# EAGLE schematic pi_day_2025 (EAGLE 9.6.2)

## Sheet 1 of 4
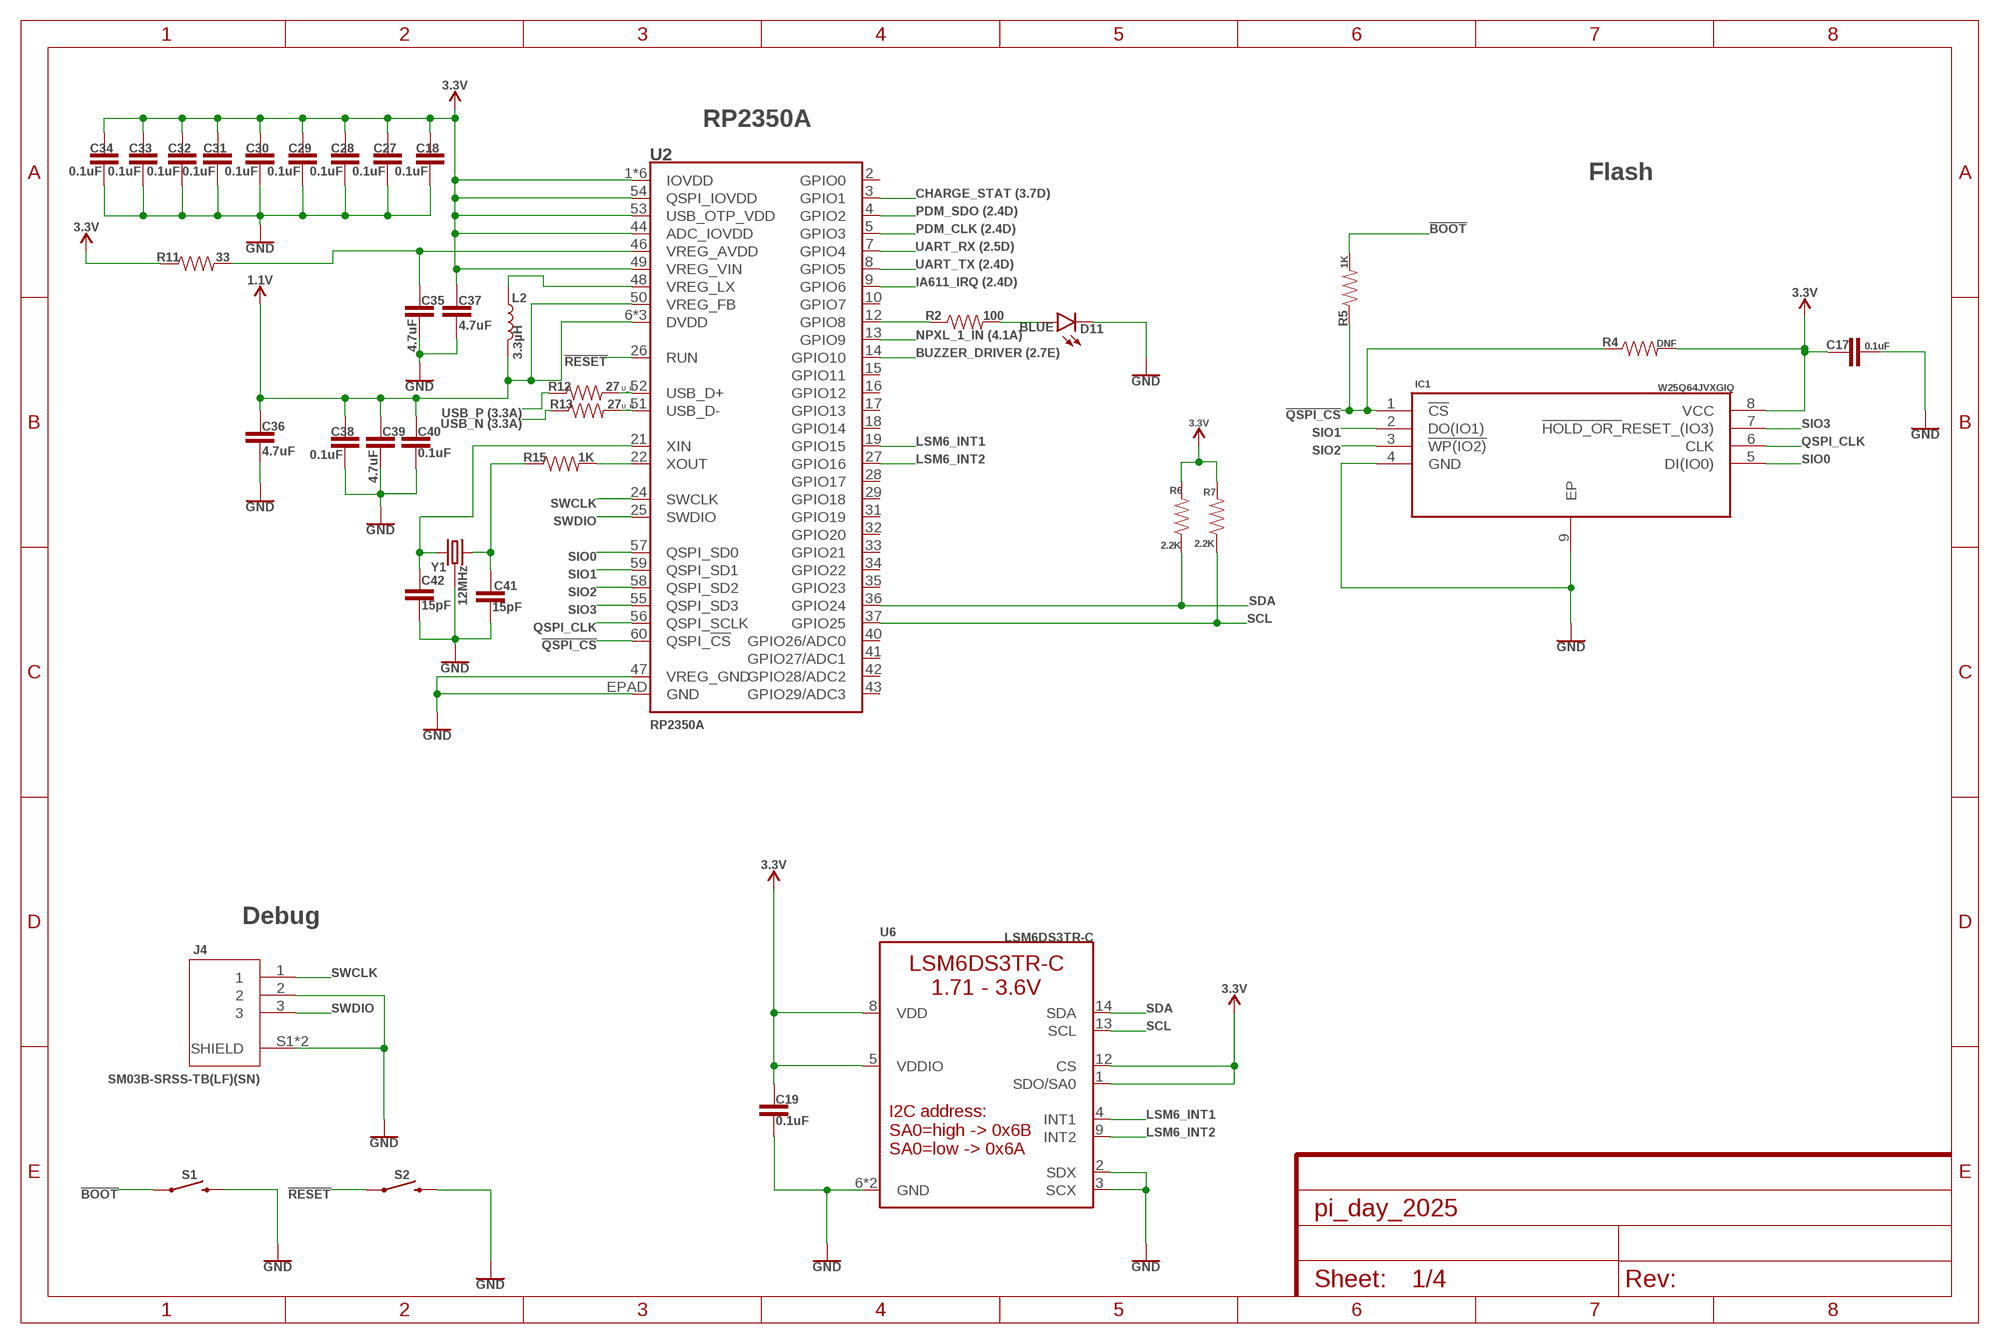
[diagram p0: schematic, sheet 1]

### Parts
C17  0.1uF  0.1UF-0402-16V-10%  [0402]
C18  0.1uF  0.1UF-0402T-16V-10%-X7R-WE  [0402-TIGHT]
C19  0.1uF  0.1UF-0402T-16V-10%-X7R-WE  [0402-TIGHT]
C27  0.1uF  0.1UF-0402T-16V-10%-X7R-WE  [0402-TIGHT]
C28  0.1uF  0.1UF-0402T-16V-10%-X7R-WE  [0402-TIGHT]
C29  0.1uF  0.1UF-0402T-16V-10%-X7R-WE  [0402-TIGHT]
C30  0.1uF  0.1UF-0402T-16V-10%-X7R-WE  [0402-TIGHT]
C31  0.1uF  0.1UF-0402T-16V-10%-X7R-WE  [0402-TIGHT]
C32  0.1uF  0.1UF-0402T-16V-10%-X7R-WE  [0402-TIGHT]
C33  0.1uF  0.1UF-0402T-16V-10%-X7R-WE  [0402-TIGHT]
C34  0.1uF  0.1UF-0402T-16V-10%-X7R-WE  [0402-TIGHT]
C35  4.7uF  4.7UF-0402_TIGHT-6.3V-20%-X5R  [0402-TIGHT]
C36  4.7uF  4.7UF-0402_TIGHT-6.3V-20%-X5R  [0402-TIGHT]
C37  4.7uF  4.7UF-0402_TIGHT-6.3V-20%-X5R  [0402-TIGHT]
C38  0.1uF  0.1UF-0402T-16V-10%-X7R-WE  [0402-TIGHT]
C39  4.7uF  4.7UF-0402_TIGHT-6.3V-20%-X5R  [0402-TIGHT]
C40  0.1uF  0.1UF-0402T-16V-10%-X7R-WE  [0402-TIGHT]
C41  15pF  15PF-0402-50V-5%  [0402]
C42  15pF  15PF-0402-50V-5%  [0402]
D11  BLUE  LED-BLUE0603  [LED-0603]
IC1  W25Q64JVXGIQ  [SON80P400X400X50-9N]
J4  SM03B-SRSS-TB(LF)(SN)  [JST_SM03B-SRSS-TB(LF)(SN)]
L2  3.3µH  INDUCTOR-0805-3.3UH  [0805]
R2  100  100OHM-0402-TIGHT-1/16W-1%  [0402-TIGHT]
R4  DNF  RESISTOR0402  [0402@1]
R5  1K  RESISTOR0402  [0402@1]
R6  2.2K  RESISTOR0402  [0402@1]
R7  2.2K  RESISTOR0402  [0402@1]
R11  33  33OHM-0402-1/10W-1%  [0402@1]
R12  27  27OHM  [0402-TIGHT]
R13  27  27OHM  [0402-TIGHT]
R15  1K  1KOHM-0402-1/16W-1%  [0402@1]
S1  MOMENTARY-SWITCH-SPST-SMD-4.6X2.8MM  [TACTILE_SWITCH_SMD_4.6X2.8MM]
S2  MOMENTARY-SWITCH-SPST-SMD-4.6X2.8MM  [TACTILE_SWITCH_SMD_4.6X2.8MM]
U2  RP2350A  [RP2350A]
U6  LSM6DS3TR-C  [LGA-14-2.5X3MM]
Y1  12MHz  CRYSTAL-GROUNDEDSMD-3.2X2.5  [CRYSTAL-SMD-3.2X2.5MM]

### Nets
1.1V: C36.1 C38.1 C39.1 C40.1 L2.2 U2.6(DVDD) U2.23(DVDD) U2.39(DVDD) U2.50(VREG_FB)
3.3V: C17.1 C18.1 C19.1 C27.1 C28.1 C29.1 C30.1 C31.1 C32.1 C33.1 C34.1 C37.1 IC1.8(VCC) R4.2 R6.2 R7.2 R11.1 U2.1(IOVDD) U2.11(IOVDD) U2.20(IOVDD) U2.30(IOVDD) U2.38(IOVDD) U2.44(ADC_IOVDD) U2.45(IOVDD) U2.49(VREG_VIN) U2.53(USB_OTP_VDD) U2.54(QSPI_IOVDD) U6.1(SDO/SA0) U6.5(VDDIO) U6.8(VDD) U6.12(CS) ; also sheet 2,3,4
!BOOT: R5.2 S1.1 S1.2
!QSPI_CS: IC1.1(!CS) R4.1 R5.1 U2.60(QSPI_!CS!)
!RESET: S2.1 S2.2 U2.26(RUN)
BUZZER_DRIVER: U2.14(GPIO10) ; also sheet 2
CHARGE_STAT: U2.3(GPIO1) ; also sheet 3
GND: C17.2 C18.2 C19.2 C27.2 C28.2 C29.2 C30.2 C31.2 C32.2 C33.2 C34.2 C35.2 C36.2 C37.2 C38.2 C39.2 C40.2 C41.2 C42.2 D11.C IC1.4(GND) IC1.9(EP) J4.2 J4.S1(SHIELD) J4.S2(SHIELD) S1.3 S1.4 S2.3 S2.4 U2.47(VREG_GND) U2.EPAD(GND) U6.2(SDX) U6.3(SCX) U6.6(GND) U6.7(GND) Y1.2(GND) Y1.4(GND) ; also sheet 2,3,4
IA611_IRQ: U2.9(GPIO6) ; also sheet 2
LSM6_INT1: U2.19(GPIO15) U6.4(INT1)
LSM6_INT2: U2.27(GPIO16) U6.9(INT2)
N$1: R2.1 U2.12(GPIO8)
N$2: C35.1 R11.2 U2.46(VREG_AVDD)
N$4: D11.A R2.2
N$5: L2.1 U2.48(VREG_LX)
N$11: C41.1 R15.1 Y1.3
N$12: C42.1 U2.21(XIN) Y1.1
N$13: R15.2 U2.22(XOUT)
NPXL_1_IN: U2.13(GPIO9) ; also sheet 4
PDM_CLK: U2.5(GPIO3) ; also sheet 2
PDM_SDO: U2.4(GPIO2) ; also sheet 2
QSPI_CLK: IC1.6(CLK) U2.56(QSPI_SCLK)
SCL: R7.1 U2.37(GPIO25) U6.13(SCL)
SDA: R6.1 U2.36(GPIO24) U6.14(SDA)
SIO0: IC1.5(DI(IO0)) U2.57(QSPI_SD0)
SIO1: IC1.2(DO(IO1)) U2.59(QSPI_SD1)
SIO2: IC1.3(!WP(IO2)) U2.58(QSPI_SD2)
SIO3: IC1.7(!HOLD_OR_!RESET_(IO3)) U2.55(QSPI_SD3)
SWCLK: J4.1 U2.24(SWCLK)
SWDIO: J4.3 U2.25(SWDIO)
U_N: R13.2 U2.51(USB_D-)
U_P: R12.2 U2.52(USB_D+)
UART_RX: U2.7(GPIO4) ; also sheet 2
UART_TX: U2.8(GPIO5) ; also sheet 2
USB_N [USB]: R13.1 ; also sheet 3
USB_P [USB]: R12.1 ; also sheet 3
Unconnected: U2.2(GPIO0) U2.10(GPIO7) U2.15(GPIO11) U2.16(GPIO12) U2.17(GPIO13) U2.18(GPIO14) U2.28(GPIO17) U2.29(GPIO18) U2.31(GPIO19) U2.32(GPIO20) U2.33(GPIO21) U2.34(GPIO22) U2.35(GPIO23) U2.40(GPIO26/ADC0) U2.41(GPIO27/ADC1) U2.42(GPIO28/ADC2) U2.43(GPIO29/ADC3)

### Notes on the sheet
- RP2350A
- Flash
- Debug

## Sheet 2 of 4
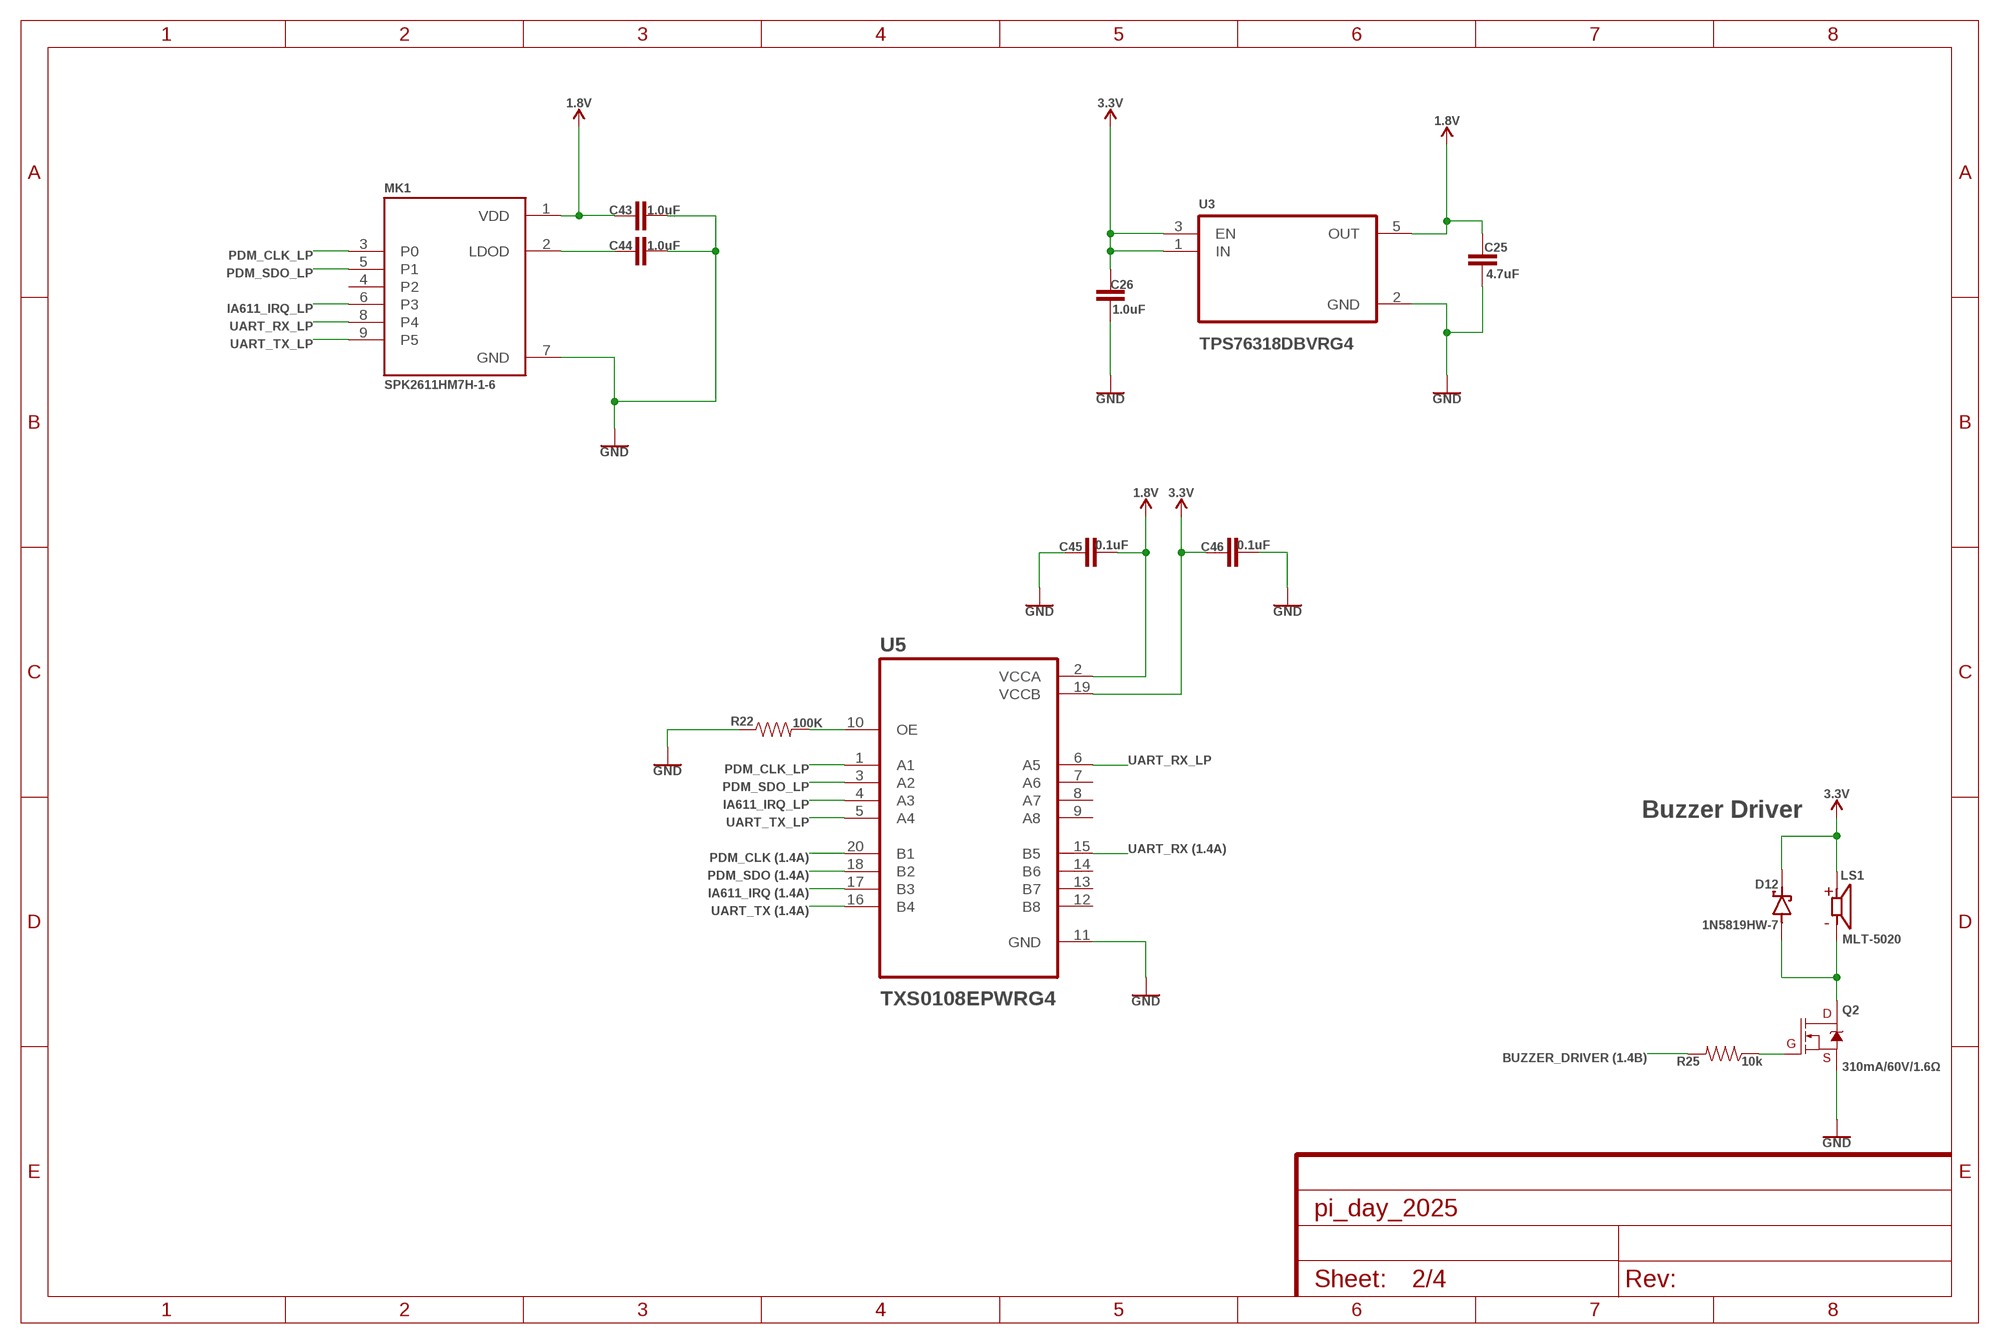
[diagram p1: schematic, sheet 2]

### Parts
C25  4.7uF  4.7UF-0402_TIGHT-6.3V-20%-X5R  [0402-TIGHT]
C26  1.0uF  1.0UF-0402-16V-10%  [0402]
C43  1.0uF  1.0UF-0402-16V-10%  [0402]
C44  1.0uF  1.0UF-0402-16V-10%  [0402]
C45  0.1uF  0.1UF-0402-6.3V-10%-X7R  [0402]
C46  0.1uF  0.1UF-0402-6.3V-10%-X7R  [0402]
D12  1N5819HW-7  [SOD3715X145N]
LS1  MLT-5020  CSS-0575A-SMT  [CUI_CSS-0575A-SMT]
MK1  SPK2611HM7H-1-6  [MIC_SPK2611HM7H-1-6]
Q2  310mA/60V/1.6Ω  MOSFET-NCH-2N7002PW  [SOT323]
R22  100K  100KOHM-0402-1/16W-1%  [0402@1]
R25  10k  10KOHM-0402-1/16W-1%  [0402]
U3  TPS76318DBVRG4  [SOT95P280X145-5N]
U5  TXS0108EPWRG4  [SOP65P640X120-20N]

### Nets
1.8V: C25.1 C43.1 C45.2 MK1.1(VDD) U3.5(OUT) U5.2(VCCA)
3.3V: C26.1 C46.1 D12.C(K) LS1.1(P) U3.1(IN) U3.3(EN) U5.19(VCCB) ; also sheet 1,3,4
BUZZER_DRIVER: R25.2 ; also sheet 1
GND: C25.2 C26.2 C43.2 C44.2 C45.1 C46.2 MK1.7(GND) Q2.2(S) R22.1 U3.2(GND) U5.11(GND) ; also sheet 1,3,4
IA611_IRQ: U5.17(B3) ; also sheet 1
IA611_IRQ_LP: MK1.6(P3) U5.4(A3)
N$23: C44.1 MK1.2(LDOD)
N$24: R22.2 U5.10(OE)
N$26: D12.A LS1.2(N) Q2.3(D)
N$27: Q2.1(G) R25.1
PDM_CLK: U5.20(B1) ; also sheet 1
PDM_CLK_LP: MK1.3(P0) U5.1(A1)
PDM_SDO: U5.18(B2) ; also sheet 1
PDM_SDO_LP: MK1.5(P1) U5.3(A2)
UART_RX: U5.15(B5) ; also sheet 1
UART_RX_LP: MK1.8(P4) U5.6(A5)
UART_TX: U5.16(B4) ; also sheet 1
UART_TX_LP: MK1.9(P5) U5.5(A4)
Unconnected: MK1.4(P2) U5.7(A6) U5.8(A7) U5.9(A8) U5.12(B8) U5.13(B7) U5.14(B6)

### Notes on the sheet
- Buzzer Driver

## Sheet 3 of 4
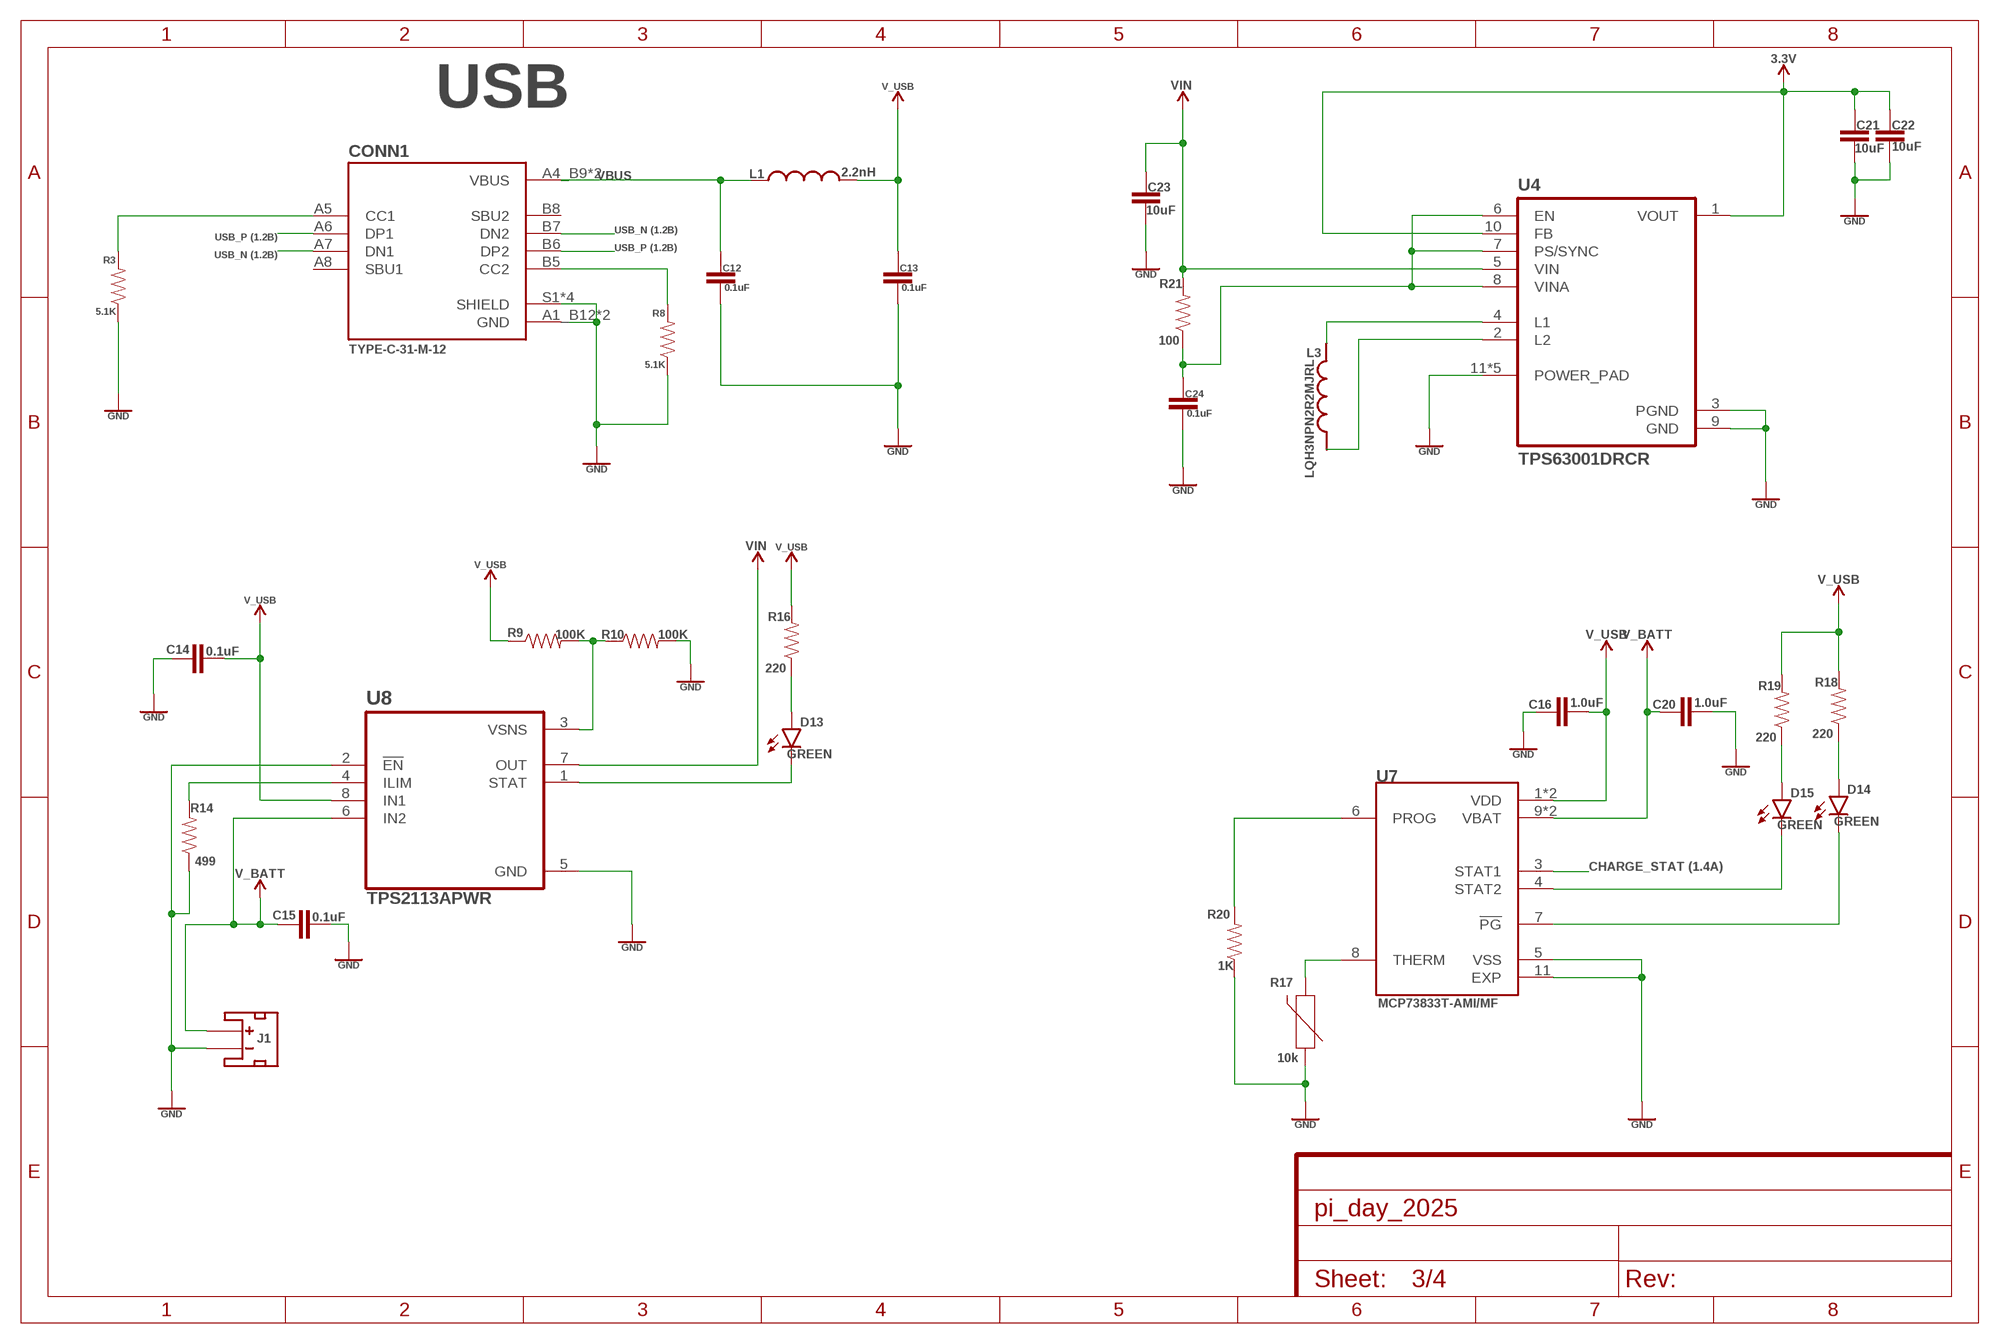
[diagram p2: schematic, sheet 3]

### Parts
C12  0.1uF  0.1UF-0402-16V-10%  [0402]
C13  0.1uF  0.1UF-0402-16V-10%  [0402]
C14  0.1uF  0.1UF-0402-10V-10%-X7R  [0402]
C15  0.1uF  0.1UF-0402-10V-10%-X7R  [0402]
C16  1.0uF  1.0UF-0402-16V-10%  [0402]
C20  1.0uF  1.0UF-0402-16V-10%  [0402]
C21  10uF  10UF-0402T-6.3V-20%  [0402-TIGHT]
C22  10uF  10UF-0402T-6.3V-20%  [0402-TIGHT]
C23  10uF  10UF-0402T-6.3V-20%  [0402-TIGHT]
C24  0.1uF  0.1UF-0402-16V-10%  [0402]
CONN1  TYPE-C-31-M-12  [HRO_TYPE-C-31-M-12]
D13  GREEN  LED-GREEN0603  [LED-0603]
D14  GREEN  LED-GREEN0603  [LED-0603]
D15  GREEN  LED-GREEN0603  [LED-0603]
J1  JST_2MM_MALE  [JST-2-SMD]
L1  2.2nH  LQW18AN2N2D10D  [INDC1608X100N]
L3  LQH3NPN2R2MJRL  [IND_LQH3NPN2R2MJRL]
R3  5.1K  RESISTOR0402  [0402@1]
R8  5.1K  RESISTOR0402  [0402@1]
R9  100K  100KOHM-0402-1/16W-1%  [0402@1]
R10  100K  100KOHM-0402-1/16W-1%  [0402@1]
R14  499  RESISTOR0402  [0402@1]
R16  220  220OHM-0402-TIGHT-1/16W-1%  [0402-TIGHT]
R17  10k  NTC-THERMISTOR-0603  [0603]
R18  220  220OHM-0402-TIGHT-1/16W-1%  [0402-TIGHT]
R19  220  220OHM-0402-TIGHT-1/16W-1%  [0402-TIGHT]
R20  1K  1KOHM-0402-1/16W-1%  [0402@1]
R21  100  100OHM-0402-TIGHT-1/16W-1%  [0402-TIGHT]
U4  TPS63001DRCR  [VREG_V62/16624-01YE]
U7  MCP73833T-AMI/MF  [SON50P300X300X100-11N]
U8  TPS2113APWR  [SOP65P640X120-8N]

### Nets
3.3V: C21.1 C22.1 U4.1(VOUT) U4.10(FB) ; also sheet 1,2,4
CHARGE_STAT: U7.3(STAT1) ; also sheet 1
GND: C12.2 C13.2 C14.1 C15.2 C16.1 C20.2 C21.2 C22.2 C23.2 C24.2 CONN1.A1_B12(GND) CONN1.B1_A12(GND) CONN1.S1(SHIELD) CONN1.S2(SHIELD) CONN1.S3(SHIELD) CONN1.S4(SHIELD) J1.1(-) R3.1 R8.1 R10.2 R14.1 R17.1 R20.1 U4.3(PGND) U4.9(GND) U4.11(POWER_PAD) U4.12(POWER_PAD) U4.13(POWER_PAD) U4.14(POWER_PAD) U4.15(POWER_PAD) U7.5(VSS) U7.11(EXP) U8.2(!EN) U8.5(GND) ; also sheet 1,2,4
N$3: CONN1.A5(CC1) R3.2
N$6: R9.2 R10.1 U8.3(VSNS)
N$7: CONN1.B5(CC2) R8.2
N$8: R14.2 U8.4(ILIM)
N$9: D13.A R16.1
N$10: D13.C U8.1(STAT)
N$14: R17.2 U7.8(THERM)
N$15: D14.A R18.1
N$16: D14.C U7.7(!PG)
N$17: D15.A R19.1
N$18: D15.C U7.4(STAT2)
N$19: R20.2 U7.6(PROG)
N$20: L3.2 U4.4(L1)
N$21: L3.1 U4.2(L2)
N$22: C24.1 R21.1 U4.6(EN) U4.7(PS/SYNC) U4.8(VINA)
USB_N [USB]: CONN1.A7(DN1) CONN1.B7(DN2) ; also sheet 1
USB_P [USB]: CONN1.A6(DP1) CONN1.B6(DP2) ; also sheet 1
V_BATT: C15.1 C20.1 J1.2(+) U7.9(VBAT) U7.10(VBAT) U8.6(IN2)
V_USB: C13.1 C14.2 C16.2 L1.2 R9.1 R16.2 R18.2 R19.2 U7.1(VDD) U7.2(VDD) U8.8(IN1)
VBUS: C12.1 CONN1.A4_B9(VBUS) CONN1.B4_A9(VBUS) L1.1
VIN: C23.1 R21.2 U4.5(VIN) U8.7(OUT)
Unconnected: CONN1.A8(SBU1) CONN1.B8(SBU2) J1.NC1(PAD1) J1.NC2(PAD2)

### Notes on the sheet
- USB

## Sheet 4 of 4
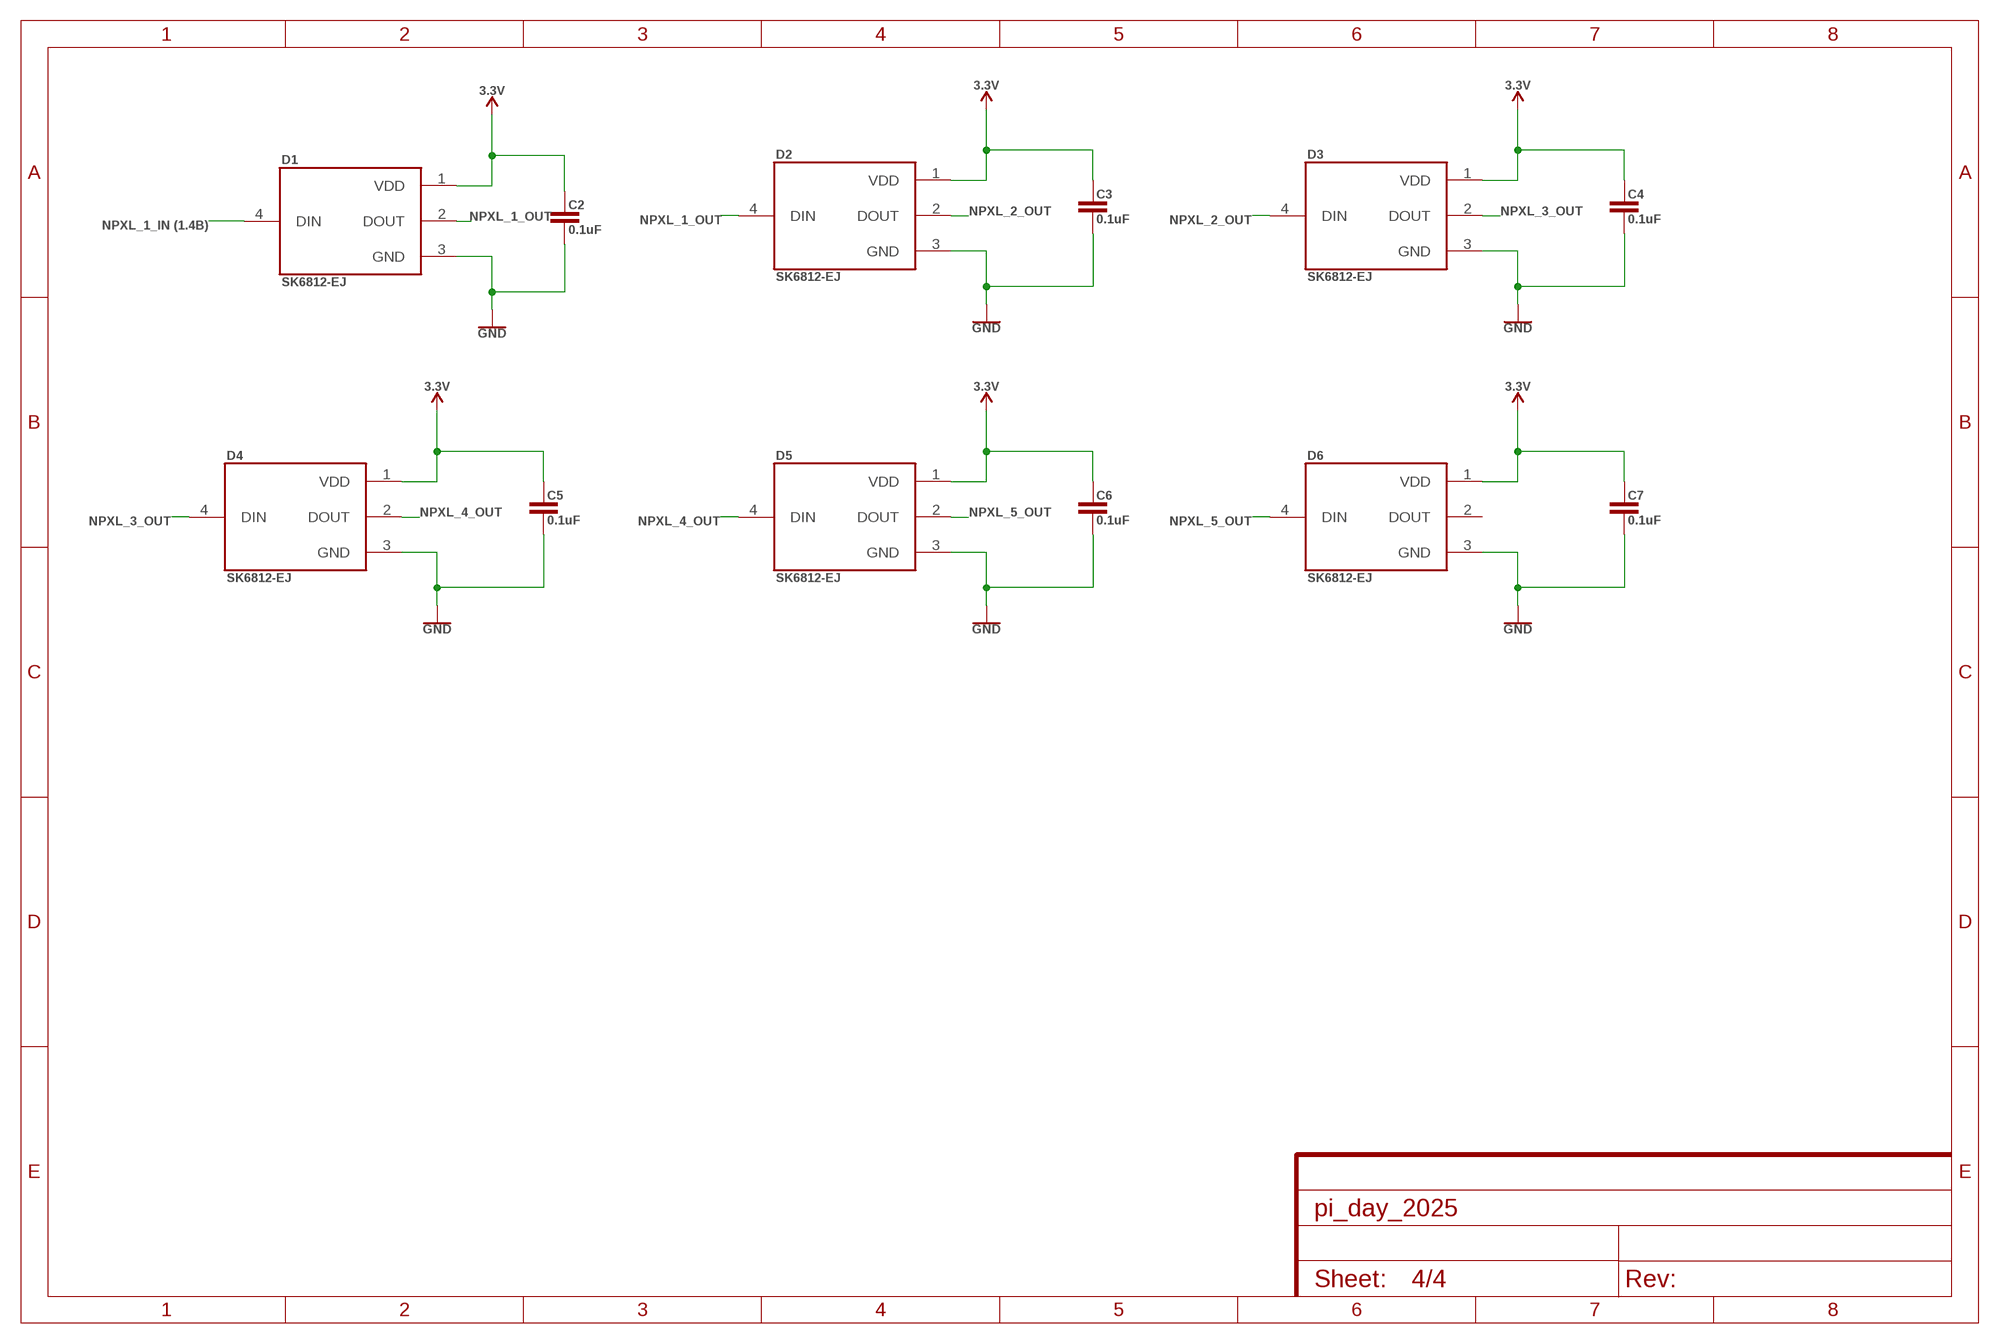
[diagram p3: schematic, sheet 4]

### Parts
C2  0.1uF  0.1UF-0402-10V-10%-X7R  [0402]
C3  0.1uF  0.1UF-0402-10V-10%-X7R  [0402]
C4  0.1uF  0.1UF-0402-10V-10%-X7R  [0402]
C5  0.1uF  0.1UF-0402-10V-10%-X7R  [0402]
C6  0.1uF  0.1UF-0402-10V-10%-X7R  [0402]
C7  0.1uF  0.1UF-0402-10V-10%-X7R  [0402]
D1  SK6812-EJ  [LED_SK6812-E]
D2  SK6812-EJ  [LED_SK6812-E]
D3  SK6812-EJ  [LED_SK6812-E]
D4  SK6812-EJ  [LED_SK6812-E]
D5  SK6812-EJ  [LED_SK6812-E]
D6  SK6812-EJ  [LED_SK6812-E]

### Nets
3.3V: C2.1 C3.1 C4.1 C5.1 C6.1 C7.1 D1.1(VDD) D2.1(VDD) D3.1(VDD) D4.1(VDD) D5.1(VDD) D6.1(VDD) ; also sheet 1,2,3
GND: C2.2 C3.2 C4.2 C5.2 C6.2 C7.2 D1.3(GND) D2.3(GND) D3.3(GND) D4.3(GND) D5.3(GND) D6.3(GND) ; also sheet 1,2,3
NPXL_1_IN: D1.4(DIN) ; also sheet 1
NPXL_1_OUT: D1.2(DOUT) D2.4(DIN)
NPXL_2_OUT: D2.2(DOUT) D3.4(DIN)
NPXL_3_OUT: D3.2(DOUT) D4.4(DIN)
NPXL_4_OUT: D4.2(DOUT) D5.4(DIN)
NPXL_5_OUT: D5.2(DOUT) D6.4(DIN)
Unconnected: D6.2(DOUT)

## Library data of the parts
C2-C7 C14 C15 = SparkFun-Capacitors:0.1UF: 0.1µF ceramic capacitors A capacitor is a passive two-terminal electrical component used to store electrical energy temporarily in an electric field.; PROD_ID: CAP-15083
C12 C13 C17 C24 = SparkFun-Capacitors:0.1UF: 0.1µF ceramic capacitors A capacitor is a passive two-terminal electrical component used to store electrical energy temporarily in an electric field.; PROD_ID: CAP-12416
C16 C20 C26 C43 C44 = SparkFun-Capacitors:1.0UF: 1µF ceramic capacitors A capacitor is a passive two-terminal electrical component used to store electrical energy temporarily in an electric field.; PROD_ID: CAP-12417
C18 C19 C27-C34 C38 C40 = SparkFun-Capacitors:0.1UF: 0.1µF ceramic capacitors A capacitor is a passive two-terminal electrical component used to store electrical energy temporarily in an electric field.; PROD_ID: CAP-16507
C21-C23 = SparkFun-Capacitors:10UF: 10.0µF ceramic capacitors A capacitor is a passive two-terminal electrical component used to store electrical energy temporarily in an electric field.; PROD_ID: CAP-14848
C25 C35-C37 C39 = SparkFun-Capacitors:4.7UF: 4.7µF ceramic capacitors A capacitor is a passive two-terminal electrical component used to store electrical energy temporarily in an electric field.; PROD_ID: CAP-14240
C41 C42 = SparkFun-Capacitors:15PF: 15pF ceramic capacitors A capacitor is a passive two-terminal electrical component used to store electrical energy temporarily in an electric field.; PROD_ID: CAP-13063
C45 C46 = SparkFun-Capacitors:0.1UF: 0.1µF ceramic capacitors A capacitor is a passive two-terminal electrical component used to store electrical energy temporarily in an electric field.; PROD_ID: CAP-14993
CONN1 = TYPE-C-31-M-12:TYPE-C-31-M-12: Check availability <https://pricing.snapeda.com/parts/TYPE-C-31-M-12/HRO%20Electronics%20Co.%2C%20Ltd./view-part?ref=eda>; AVAILABILITY: Not in stock; CHECK_PRICES: https://www.snapeda.com/parts/TYPE-C-31-M-12/HRO+Electronics+Co.%252C+Ltd./view-part/?ref=eda; DESCRIPTION: USB Connectors 24 Receptacle 1 8.94*7.3mm RoHS; MF: HRO Electronics Co., Ltd.; MP: TYPE-C-31-M-12; PACKAGE: Package; PRICE: None; SNAPEDA_LINK: https://www.snapeda.com/parts/TYPE-C-31-M-12/HRO+Electronics+Co.%252C+Ltd./view-part/?ref=snap
D1-D6 = SK6812-E:SK6812-E: Check availability <https://pricing.snapeda.com/parts/SK6812-E/DONGGUANG%20OPSCO%20OPTOELECTRONICS%20CO.%2C%20LTD/view-part?ref=eda>; AVAILABILITY: Not in stock; CHECK_PRICES: https://www.snapeda.com/parts/SK6812-E/DONGGUANG+OPSCO+OPTOELECTRONICS+CO.%252C+LTD/view-part/?ref=eda; DESCRIPTION: SK6812MINI-E is a smart LED control circuit and light emitting circuit in one controlled LED source, which has the shape of a 3528 LED chip.; MF: DONGGUANG OPSCO OPTOELECTRONICS CO., LTD; MP: SK6812-E; PACKAGE: Package; PRICE: None; SNAPEDA_LINK: https://www.snapeda.com/parts/SK6812-E/DONGGUANG+OPSCO+OPTOELECTRONICS+CO.%252C+LTD/view-part/?ref=snap
D11 = SparkFun-LED:LED-BLUE: Blue SMD LED Used in manufacturing of various products at SparkFun Packages: 0603 - SMD 0603 package [Product Link] <http://www.digikey.com/product-detail/en/SMLE12BC7TT86/511-1589-2-ND/1641808> 1206 - SMD1206 package [Product Link] <http://www.digikey.com/product-detail/en/lite-on-inc/LTST-C150TBKT/160-1643-1-ND/573584> SparkFun Products: ESP8266 Thing-Dev Board <https://www.sparkfun.com/products/13711> RedBoard <https://www.sparkfun.com/products/12757>; PROD_ID: DIO-08575
D12 = 1N5819HW-7:1N5819HW-7: 1N5819HW Series 40 V 1 A Surface Mount Schottky Barrier Rectifier - SOD-123 Check availability <https://pricing.snapeda.com/parts/1N5819HW-7/Diodes%20Inc./view-part?ref=eda>; AVAILABILITY: In Stock; CHECK_PRICES: https://www.snapeda.com/parts/1N5819HW-7/Diodes+Inc./view-part/?ref=eda; DESCRIPTION: Diode Schottky 40 V 1A Surface Mount SOD-123; MF: Diodes Inc.; MP: 1N5819HW-7; PACKAGE: SOD-123 Fairchild Semiconductor; PRICE: None; PURCHASE-URL: https://www.snapeda.com/api/url_track_click_mouser/?unipart_id=51510&manufacturer=Diodes Inc.&part_name=1N5819HW-7&search_term=1n5819hw-7; SNAPEDA_LINK: https://www.snapeda.com/parts/1N5819HW-7/Diodes+Inc./view-part/?ref=snap
D13-D15 = SparkFun-LED:LED-GREEN: Green SMD LED Used in manufacturing of various products at SparkFun Packages: 0603 - SMD 0603 package [Product Link] <http://www.futureelectronics.com/en/technologies/semiconductors/optoelectronics/leds/Pages/9894312-LTST-C190GKT.aspx?CrossPart=HSMG-C190&IM=0> LilyPad 1206 - SMD1206 LilyPad package [Product Link] <http://www.futureelectronics.com/en/Technologies/Product.aspx?ProductID=IN150NGHARVATEKCORPORATION2049943&IM=0> 1206 - SMD1206 package [Product Link] <http://www.futureelectronics.com/en/technologies/semiconductors/optoelectronics/leds/Pages/8315665-LTST-C150KGKT.aspx?IM=0> 1206 Bottom Mount -SMD 1206 Bottom Mount [Product Link] <http://www.digikey.com/product-detail/en/lite-on-inc/LTST-C230KGKT/160-1456-1-ND/386854> SparkFun Products: Pro Mini 328 -5V <https://www.sparkfun.com/products/821> RedBoard <https://www.sparkfun.com/products/12757> MP3 Trigger <https://www.sparkfun.com/products/13720> Makey Makey <https://www.sparkfun.com/products/11076>; PROD_ID: DIO-00821
IC1 = SamacSys_Parts:W25Q64JVXGIQ: 64M-bit Serial Flash Memory with uniform 4KB sectors and Dual/Quad SPI Source: Datasheet <https://www.winbond.com/hq/search-resource-file.jsp?partNo=W25Q64JVXGIQ&type=datasheet>; DESCRIPTION: 64M-bit Serial Flash Memory with uniform 4KB sectors and Dual/Quad SPI; HEIGHT: 0.5mm; MANUFACTURER_NAME: Winbond; MANUFACTURER_PART_NUMBER: W25Q64JVXGIQ
J1 = SparkFun-Connectors:JST_2MM_MALE: JST 2MM MALE RA CONNECTOR Two pin, compact surface mount connector. Commonly used as a battery input connection point. We really like the solid locking feeling and high current rating on these small connectors. We use these all the time as battery connectors. Mates to single-cell LiPo batteries. Here is the connector we sell at SparkFun: JST Right Angle Connector - White <https://www.sparkfun.com/products/8612> (PRT-08612) Datasheet <http://www.sparkfun.com/datasheets/Prototyping/Connectors/JST-Horizontal.pdf> It was used on these SparkFun products: SparkFun MOSFET Power Controller <https://www.sparkfun.com/products/11214> (PRT-11214) SparkFun Battery Babysitter - LiPo Battery Manager <https://www.sparkfun.com/products/13777> (PRT-13777) And many, many others that required a lipo battery connection.; PROD_ID: CONN-11443; SF_ID: PRT-08612
J4 = SM03B-SRSS-TB_LF__SN_:SM03B-SRSS-TB(LF)(SN): SH Series 3 Position 1 mm Pitch Surface Mount Side Entry Shrouded Header Check availability <https://pricing.snapeda.com/parts/SM03B-SRSS-TB%28LF%29%28SN%29/JST%20Sales%20America%20Inc./view-part?ref=eda>; AVAILABILITY: In Stock; CHECK_PRICES: https://www.snapeda.com/parts/SM03B-SRSS-TB(LF)(SN)/JST+Sales+America+Inc./view-part/?ref=eda; DESCRIPTION: Connector Header Surface Mount, Right Angle 3 position 0.039 (1.00mm); MF: JST Sales America Inc.; MP: SM03B-SRSS-TB(LF)(SN); PACKAGE: None; PRICE: None; SNAPEDA_LINK: https://www.snapeda.com/parts/SM03B-SRSS-TB(LF)(SN)/JST+Sales+America+Inc./view-part/?ref=snap
L1 = LQW18AN2N2D10D:LQW18AN2N2D10D: Inductor RF Chip Unshielded Wirewound 2.2nH 0.5nH 100MHz 25Q-Factor Ceramic 1.4A 18mOhm DCR 0603 T/R Check availability <https://pricing.snapeda.com/parts/LQW18AN2N2D10D/Murata/view-part?ref=eda>; AVAILABILITY: In Stock; CHECK_PRICES: https://www.snapeda.com/parts/LQW18AN2N2D10D/Murata/view-part/?ref=eda; DESCRIPTION: Inductor with Inductance: 2.2nH Tol. +/-0.5nH, Package: 0603 (1608); MF: Murata; MP: LQW18AN2N2D10D; PACKAGE: 1608 Murata; PRICE: None; PURCHASE-URL: https://www.snapeda.com/api/url_track_click_mouser/?unipart_id=1503005&manufacturer=Murata&part_name=LQW18AN2N2D10D&search_term=2.2nh 0603; SNAPEDA_LINK: https://www.snapeda.com/parts/LQW18AN2N2D10D/Murata/view-part/?ref=snap
L2 = SparkFun-Coils:INDUCTOR: Inductors Resist changes in electrical current. Basically a coil of wire. SparkFun Products: SparkFun Load Cell Amplifier - HX711 <https://www.sparkfun.com/products/13879> IOIO-OTG - V2.2 <https://www.sparkfun.com/products/13613>; PROD_ID: NDUC-13076; VALUE: 3.3µH/±20%/450mA
L3 = LQH3NPN2R2MJRL:LQH3NPN2R2MJRL: Inductor Power Chip Shielded Wirewound 33uH 20% 1MHz Ferrite 0.63A 0.948Ohm DCR 1212 T/R Check availability <https://pricing.snapeda.com/parts/LQH3NPN2R2MJRL/Murata/view-part?ref=eda>; AVAILABILITY: In Stock; CHECK_PRICES: https://www.snapeda.com/parts/LQH3NPN2R2MJRL/Murata/view-part/?ref=eda; DESCRIPTION: Inductor with Inductance: 2.2uH Tol. +/-20%, Package: 1212 (3030); MF: Murata; MP: LQH3NPN2R2MJRL; PACKAGE: NONSTANDARD; PRICE: None; SNAPEDA_LINK: https://www.snapeda.com/parts/LQH3NPN2R2MJRL/Murata/view-part/?ref=snap
LS1 = CSS-0575A-SMT:CSS-0575A-SMT: 5 mm, 3 V, 75 dB, Surface Mount (SMT), Magnetic Audio Transducer Buzzer; AVAILABILITY: Unavailable; DESCRIPTION: 5 mm, 3 V, 75 dB, Surface Mount _SMT_, Magnetic Audio Transducer Buzzer; MF: CUI; MP: CSS-0575A-SMT; PACKAGE: None; PRICE: None
MK1 = SPK2611HM7H-1-6:SPK2611HM7H-1-6: Digital, PDM Microphone MEMS (Silicon) 1.71V ~ 1.98V Omnidirectional () Solder Pads; CHECK_PRICES: https://www.snapeda.com/parts/SPK2611HM7H-1-6/Knowles/view-part/?ref=eda; DESCRIPTION: Digital, PDM Microphone MEMS (Silicon) 1.71 V ~ 1.98 V Omnidirectional () Solder Pads; MF: Knowles; MP: SPK2611HM7H-1-6; PACKAGE: Knowles; SNAPEDA_LINK: https://www.snapeda.com/parts/SPK2611HM7H-1-6/Knowles/view-part/?ref=snap
Q2 = SparkFun-DiscreteSemi:MOSFET-NCH: N-channel MOSFETs Voltage controlled devices that allow control of high current outputs. SparkFun Products: SparkFun OpenScale <https://www.sparkfun.com/products/13261> SparkFun Digital Sandbox <https://www.sparkfun.com/products/12651> SparkFun Monster Moto Shield <https://www.sparkfun.com/products/10182> SparkFun MOSFET Power Controller <https://www.sparkfun.com/products/11214>; PROD_ID: TRANS-11151
R2 R21 = SparkFun-Resistors:100OHM: 100Ω resistor A resistor is a passive two-terminal electrical component that implements electrical resistance as a circuit element. Resistors act to reduce current flow, and, at the same time, act to lower voltage levels within circuits. - Wikipedia; PROD_ID: RES-14962
R3-R8 R14 = SparkFun-Resistors:RESISTOR: Generic Resistor Package
R9 R10 R22 = SparkFun-Resistors:100KOHM: 100kΩ resistor A resistor is a passive two-terminal electrical component that implements electrical resistance as a circuit element. Resistors act to reduce current flow, and, at the same time, act to lower voltage levels within circuits. - Wikipedia; PROD_ID: RES-13495
R11 = SparkFun-Resistors:33OHM: 33Ω resistor A resistor is a passive two-terminal electrical component that implements electrical resistance as a circuit element. Resistors act to reduce current flow, and, at the same time, act to lower voltage levels within circuits. - Wikipedia; PROD_ID: RES-14883
R12 R13 = SparkFun-Resistors:27OHM: 27Ω resistor A resistor is a passive two-terminal electrical component that implements electrical resistance as a circuit element. Resistors act to reduce current flow, and, at the same time, act to lower voltage levels within circuits. - Wikipedia; PROD_ID: RES-15238
R15 R20 = SparkFun-Resistors:1KOHM: 1kΩ resistor A resistor is a passive two-terminal electrical component that implements electrical resistance as a circuit element. Resistors act to reduce current flow, and, at the same time, act to lower voltage levels within circuits. - Wikipedia; PROD_ID: RES-14342
R16 R18 R19 = SparkFun-Resistors:220OHM: 220Ω resistor A resistor is a passive two-terminal electrical component that implements electrical resistance as a circuit element. Resistors act to reduce current flow, and, at the same time, act to lower voltage levels within circuits. - Wikipedia; PROD_ID: RES-15269
R17 = SparkFun-Resistors:NTC-THERMISTOR: NTC Thermistor An NTC thermistor's resistance decreases as temperature rises. Applications: Resistance Thermometer - temperature monitoring Inrush current limiter Heat source; PROD_ID: RES-13608
R25 = SparkFun-Resistors:10KOHM: 10kΩ resistor A resistor is a passive two-terminal electrical component that implements electrical resistance as a circuit element. Resistors act to reduce current flow, and, at the same time, act to lower voltage levels within circuits. - Wikipedia; PROD_ID: RES-14241
S1 S2 = SparkFun-Switches:MOMENTARY-SWITCH-SPST: Momentary Switch (Pushbutton) - SPST Normally-open (NO) SPST momentary switches (buttons, pushbuttons). Variants PTH-12MM - 12mm square, through-hole Momentary Pushbutton Switch - 12mm Square <https://www.sparkfun.com/products/9190> (COM-09190) PTH-6.0MM, PTH-6.0MM-KIT - 6.0mm square, through-hole Mini Pushbutton Switch <https://www.sparkfun.com/products/97> (COM-00097) KIT package intended for soldering kit's - only one side of pads' copper is exposed. PTH-RIGHT-ANGLE-KIT - Right-angle, through-hole Right Angle Tactile Button <https://www.sparkfun.com/products/10791> - Used on SparkFun BigTime Watch Kit <https://www.sparkfun.com/products/11734> SMD-12MM - 12mm square, surface-mount Tactile Button - SMD (12mm) <https://www.sparkfun.com/products/12993> (COM-12993) Used on SparkFun PicoBoard <https://www.sparkfun.com/products/11888> SMD-4.5MM - 4.5mm Square Trackball Switch Used on SparkFun Blackberry Trackballer Breakout <https://www.sparkfun.com/products/13169> SMD-4.6MMX2.8MM - 4.60mm x 2.80mm, surface mount Used on SparkFun Pro Micro - RP2040 <https://www.sparkfun.com/products/17717> SMD-5.2MM, SMD-5.2-REDUNDANT - 5.2mm square, surface-mount Mini Pushbutton Switch - SMD <https://www.sparkfun.com/products/8720> (COM-08720) Used on Arduino Pro Mini <https://www.sparkfun.com/products/11114> REDUNDANT package connects both switch circuits together SMD-6.0X3.5MM - 6.0 x 3.5mm, surface mount Momentary Reset Switch SMD <https://www.sparkfun.com/products/8229> (COM-08229) SMD-6.2MM-TALL - 6.2mm square, surface mount Tactile Button - SMD (6mm) <https://www.sparkfun.com/products/12992> Used on SparkFun Digital Sandbox <https://www.sparkfun.com/products/12651> SMD-RIGHT-ANGLE - Right-angle, surface mount Used on SparkFun Block for Intel® Edison - Arduino <https://www.sparkfun.com/products/13036>; PROD_ID: SWCH-15606
U2 = RP2350A:RP2350A; PROD_ID: IC-21276
U3 = TPS76318DBVRG4:TPS76318DBVRG4; CHECK_PRICES: https://www.snapeda.com/parts/TPS76318DBVRG4/Texas+Instruments/view-part/?ref=eda; DESCRIPTION: 150-mA, 10-V, low-dropout voltage regulator with enable 5-SOT-23 -40 to 125; DIGIKEY_PART_NUMBER: TPS76318DBVRG4-ND; MF: Texas Instruments; MP: TPS76318DBVRG4; PACKAGE: SOT-23-5 Texas Instruments; SNAPEDA_LINK: https://www.snapeda.com/parts/TPS76318DBVRG4/Texas+Instruments/view-part/?ref=snap
U4 = TPS63001DRCR:TPS63001DRCR: Check availability <https://pricing.snapeda.com/parts/TPS63001DRCR/Texas%20Instruments/view-part?ref=eda>; AVAILABILITY: In Stock; CHECK_PRICES: https://www.snapeda.com/parts/TPS63001DRCR/Texas+Instruments/view-part/?ref=eda; DESCRIPTION: 96% Buck-Boost Converter with 1.7A Current Switches, 3.3V fixed Output voltage in 3x3 QFN; MF: Texas Instruments; MP: TPS63001DRCR; PACKAGE: VSON-10 Texas Instruments; PRICE: None; SNAPEDA_LINK: https://www.snapeda.com/parts/TPS63001DRCR/Texas+Instruments/view-part/?ref=snap
U5 = TXS0108EPWRG4:TXS0108EPWRG4; CHECK_PRICES: https://www.snapeda.com/parts/TXS0108EPWRG4/Texas+Instruments/view-part/?ref=eda; DESCRIPTION: 8-bit bidirectional voltage-level shifter for open-drain and push-pull application 20-TSSOP -40 to 85; DIGIKEY_PART_NUMBER: 296-46258-2-ND; MF: Texas Instruments; MP: TXS0108EPWRG4; PACKAGE: TSSOP-20 Texas Instruments; SNAPEDA_LINK: https://www.snapeda.com/parts/TXS0108EPWRG4/Texas+Instruments/view-part/?ref=snap
U6 = LSM6DS3TR-C:LSM6DS3TR-C: Check availability <https://pricing.snapeda.com/parts/LSM6DS3TR-C/STMicroelectronics/view-part?ref=eda>; AVAILABILITY: In Stock; CHECK_PRICES: https://www.snapeda.com/parts/LSM6DS3TR-C/STMicroelectronics/view-part/?ref=eda; DESCRIPTION: IMUs - Inertial Measurement Units iNEMO 6DoF inertial module, for entry level / mid-tier smart phones and Portable PC platforms; MF: STMicroelectronics; MP: LSM6DS3TR-C; PACKAGE: None; PRICE: None; SNAPEDA_LINK: https://www.snapeda.com/parts/LSM6DS3TR-C/STMicroelectronics/view-part/?ref=snap
U7 = MCP73833T-AMI_MF:MCP73833T-AMI/MF: Linear Charge Management Controller Li-Ion/Li-Pol 1mA 4.2V/4.35V/4.4V/4.5V 10-Pin DFN EP T/R Check availability <https://pricing.snapeda.com/parts/MCP73833T-AMI/MF/Microchip/view-part?ref=eda>; AVAILABILITY: In Stock; CHECK_PRICES: https://www.snapeda.com/parts/MCP73833T-AMI/MF/Microchip/view-part/?ref=eda; DESCRIPTION: 1A Li-Ion/Li-Poly Charge mgmt controller, PG output10 DFN 3x3x0.9mm T/R | Microchip Technology Inc. MCP73833T-AMI/MF; MF: Microchip; MP: MCP73833T-AMI/MF; PACKAGE: DFN-10 Microchip; PRICE: None; SNAPEDA_LINK: https://www.snapeda.com/parts/MCP73833T-AMI/MF/Microchip/view-part/?ref=snap
U8 = TPS2113APWR:TPS2113APWR: Check availability <https://pricing.snapeda.com/parts/TPS2113APWR/Texas%20Instruments/view-part?ref=eda>; AVAILABILITY: In Stock; CHECK_PRICES: https://www.snapeda.com/parts/TPS2113APWR/Texas+Instruments/view-part/?ref=eda; DESCRIPTION: 2.8-V to 5.5-V, 84-mΩ, 1.25-A, power mux with automatic switchover and status output; MF: Texas Instruments; MP: TPS2113APWR; PACKAGE: TSSOP-8 Texas Instruments; PRICE: None; SNAPEDA_LINK: https://www.snapeda.com/parts/TPS2113APWR/Texas+Instruments/view-part/?ref=snap
Y1 = SparkFun-Clocks:CRYSTAL-GROUNDED: Crystals w/ Ground Pin (Generic) These are passive quartz crystals, which can be used as a clock source for a microcontroller. Crystal's are usually two-terminal devices. A third terminal may be optionally connected to ground, as recommended by the manufaturer.; PROD_ID: XTAL-13518